# Altium schematic sheet UI_BUTTON_LED.SchDoc
size 297 x 209 mm
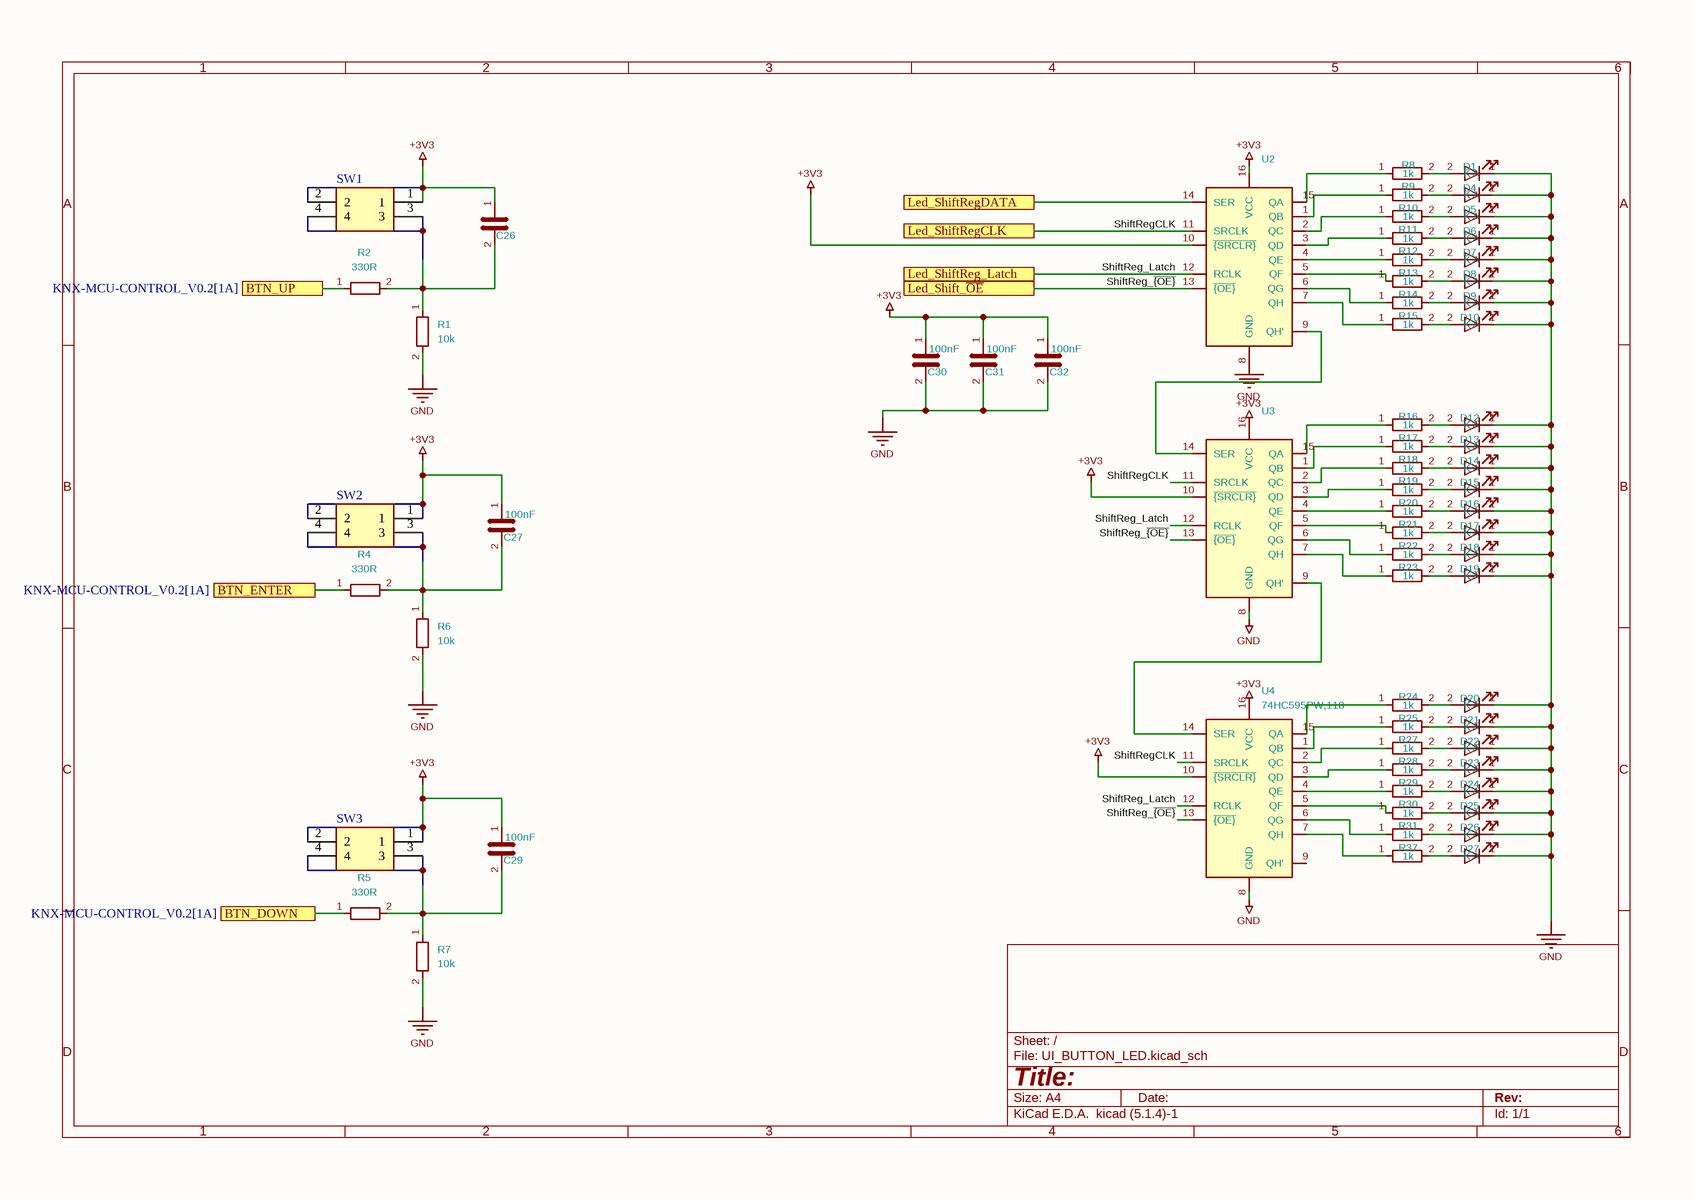
[diagram p0: UI_BUTTON_LED.SchDoc]

## Parts
C26  100nF  [C_0603_1608Metric]  (value not drawn)
C27  100nF  [C_0603_1608Metric]
C29  100nF  [C_0603_1608Metric]
C30  100nF  [C_0603_1608Metric]
C31  100nF  [C_0603_1608Metric]
C32  100nF  [C_0603_1608Metric]
D1  LED  [LED_0603_1608Metric]  (value not drawn)
D4  LED  [LED_0603_1608Metric]  (value not drawn)
D5  LED  [LED_0603_1608Metric]  (value not drawn)
D6  LED  [LED_0603_1608Metric]  (value not drawn)
D7  LED  [LED_0603_1608Metric]  (value not drawn)
D8  LED  [LED_0603_1608Metric]  (value not drawn)
D9  LED  [LED_0603_1608Metric]  (value not drawn)
D10  LED  [LED_0603_1608Metric]  (value not drawn)
D12  LED  [LED_0603_1608Metric]  (value not drawn)
D13  LED  [LED_0603_1608Metric]  (value not drawn)
D14  LED  [LED_0603_1608Metric]  (value not drawn)
D15  LED  [LED_0603_1608Metric]  (value not drawn)
D16  LED  [LED_0603_1608Metric]  (value not drawn)
D17  LED  [LED_0603_1608Metric]  (value not drawn)
D18  LED  [LED_0603_1608Metric]  (value not drawn)
D19  LED  [LED_0603_1608Metric]  (value not drawn)
D20  LED  [LED_0603_1608Metric]  (value not drawn)
D21  LED  [LED_0603_1608Metric]  (value not drawn)
D22  LED  [LED_0603_1608Metric]  (value not drawn)
D23  LED  [LED_0603_1608Metric]  (value not drawn)
D24  LED  [LED_0603_1608Metric]  (value not drawn)
D25  LED  [LED_0603_1608Metric]  (value not drawn)
D26  LED  [LED_0603_1608Metric]  (value not drawn)
D27  LED  [LED_0603_1608Metric]  (value not drawn)
R1  10k  [R_0603_1608Metric]
R2  330R  [R_0603_1608Metric]
R4  330R  [R_0603_1608Metric]
R5  330R  [R_0603_1608Metric]
R6  10k  [R_0603_1608Metric]
R7  10k  [R_0603_1608Metric]
R8  1k  [R_0603_1608Metric]
R9  1k  [R_0603_1608Metric]
R10  1k  [R_0603_1608Metric]
R11  1k  [R_0603_1608Metric]
R12  1k  [R_0603_1608Metric]
R13  1k  [R_0603_1608Metric]
R14  1k  [R_0603_1608Metric]
R15  1k  [R_0603_1608Metric]
R16  1k  [R_0603_1608Metric]
R17  1k  [R_0603_1608Metric]
R18  1k  [R_0603_1608Metric]
R19  1k  [R_0603_1608Metric]
R20  1k  [R_0603_1608Metric]
R21  1k  [R_0603_1608Metric]
R22  1k  [R_0603_1608Metric]
R23  1k  [R_0603_1608Metric]
R24  1k  [R_0603_1608Metric]
R25  1k  [R_0603_1608Metric]
R27  1k  [R_0603_1608Metric]
R28  1k  [R_0603_1608Metric]
R29  1k  [R_0603_1608Metric]
R30  1k  [R_0603_1608Metric]
R31  1k  [R_0603_1608Metric]
R37  1k  [R_0603_1608Metric]
SW1  TSA06141-225B532CA-3C00  [TL1105]  (value not drawn)
SW2  TSA06141-225B532CA-3C00  [TL1105]  (value not drawn)
SW3  TSA06141-225B532CA-3C00  [TL1105]  (value not drawn)
U2  74HC595PW,118  [TSSOP-16_4.4x5mm_P0.65mm]  (value not drawn)
U3  74HC595PW,118  [TSSOP-16_4.4x5mm_P0.65mm]  (value not drawn)
U4  74HC595PW,118  [TSSOP-16_4.4x5mm_P0.65mm]

## Ports
BTN_DOWN (see KNX-MCU-CONTROL_V0.2[1A]), BTN_ENTER (see KNX-MCU-CONTROL_V0.2[1A]), BTN_UP (see KNX-MCU-CONTROL_V0.2[1A]), Led_Shift_~{OE} (see KNX-MCU-CONTROL_V0.2[2A]), Led_ShiftReg_Latch (see KNX-MCU-CONTROL_V0.2[2A]), Led_ShiftRegCLK (see KNX-MCU-CONTROL_V0.2[2A]), Led_ShiftRegDATA (see KNX-MCU-CONTROL_V0.2[2A])

## Nets
+3V3: C26.1 C27.1 C29.1 C30.1 C31.1 C32.1 SW1.1 SW1.2 SW2.1 SW2.2 SW3.1 SW3.2 U2.10(~{{SRCLR}}) U2.16(VCC) U3.10(~{{SRCLR}}) U3.16(VCC) U4.10(~{{SRCLR}}) U4.16(VCC)
GND: C30.2 C31.2 C32.2 D1.1(K) D4.1(K) D5.1(K) D6.1(K) D7.1(K) D8.1(K) D9.1(K) D10.1(K) D12.1(K) D13.1(K) D14.1(K) D15.1(K) D16.1(K) D17.1(K) D18.1(K) D19.1(K) D20.1(K) D21.1(K) D22.1(K) D23.1(K) D24.1(K) D25.1(K) D26.1(K) D27.1(K) R1.2 R6.2 R7.2 U2.8(GND) U3.8(GND) U4.8(GND)
BTN_DOWN: R5.1 ; port BTN_DOWN
BTN_ENTER: R4.1 ; port BTN_ENTER
BTN_UP: R2.1 ; port BTN_UP
Led_ShiftRegDATA: U2.14(SER) ; port Led_ShiftRegDATA
ShiftReg_Latch: U2.12(RCLK) U3.12(RCLK) U4.12(RCLK) ; port Led_ShiftReg_Latch
ShiftReg_~{{OE}}: U2.13(~{{OE}}) U3.13(~{{OE}}) U4.13(~{{OE}}) ; port Led_Shift_~{OE}
ShiftRegCLK: U2.11(SRCLK) U3.11(SRCLK) U4.11(SRCLK) ; port Led_ShiftRegCLK
NetC26_2: C26.2 R1.1 R2.2 SW1.3 SW1.4
NetC27_2: C27.2 R4.2 R6.1 SW2.3 SW2.4
NetC29_2: C29.2 R5.2 R7.1 SW3.3 SW3.4
NetD1_2: D1.2(A) R8.2
NetD4_2: D4.2(A) R9.2
NetD5_2: D5.2(A) R10.2
NetD6_2: D6.2(A) R11.2
NetD7_2: D7.2(A) R12.2
NetD8_2: D8.2(A) R13.2
NetD9_2: D9.2(A) R14.2
NetD10_2: D10.2(A) R15.2
NetD12_2: D12.2(A) R16.2
NetD13_2: D13.2(A) R17.2
NetD14_2: D14.2(A) R18.2
NetD15_2: D15.2(A) R19.2
NetD16_2: D16.2(A) R20.2
NetD17_2: D17.2(A) R21.2
NetD18_2: D18.2(A) R22.2
NetD19_2: D19.2(A) R23.2
NetD20_2: D20.2(A) R24.2
NetD21_2: D21.2(A) R25.2
NetD22_2: D22.2(A) R27.2
NetD23_2: D23.2(A) R28.2
NetD24_2: D24.2(A) R29.2
NetD25_2: D25.2(A) R30.2
NetD26_2: D26.2(A) R31.2
NetD27_2: D27.2(A) R37.2
NetR8_1: R8.1 U2.15(QA)
NetR9_1: R9.1 U2.1(QB)
NetR10_1: R10.1 U2.2(QC)
NetR11_1: R11.1 U2.3(QD)
NetR12_1: R12.1 U2.4(QE)
NetR13_1: R13.1 U2.5(QF)
NetR14_1: R14.1 U2.6(QG)
NetR15_1: R15.1 U2.7(QH)
NetR16_1: R16.1 U3.15(QA)
NetR17_1: R17.1 U3.1(QB)
NetR18_1: R18.1 U3.2(QC)
NetR19_1: R19.1 U3.3(QD)
NetR20_1: R20.1 U3.4(QE)
NetR21_1: R21.1 U3.5(QF)
NetR22_1: R22.1 U3.6(QG)
NetR23_1: R23.1 U3.7(QH)
NetR24_1: R24.1 U4.15(QA)
NetR25_1: R25.1 U4.1(QB)
NetR27_1: R27.1 U4.2(QC)
NetR28_1: R28.1 U4.3(QD)
NetR29_1: R29.1 U4.4(QE)
NetR30_1: R30.1 U4.5(QF)
NetR31_1: R31.1 U4.6(QG)
NetR37_1: R37.1 U4.7(QH)
NetU2_9: U2.9(QH') U3.14(SER)
NetU3_9: U3.9(QH') U4.14(SER)

Not connected (* = marked no-connect by the designer): U4 9(QH')

## Notes on the sheet
- 1
- 2
- 3
- 4
- 5
- 6
- A
- B
- C
- D
- Title:
- File: UI_BUTTON_LED.kicad_sch
- Sheet: /
- KiCad E.D.A.  kicad (5.1.4)-1
- Size: A4
- Date:
- Rev:
- Id: 1/1

## Library data of the parts
C26 C27 C29 = C_3: Manufacturer Part Number: CC0603KRX7R9BB104; Manufacturer: YAGEO; Value: 100nF; Footprint: Capacitor_SMD:C_0603_1608Metric
C30-C32 = C_1: Manufacturer Part Number: CC0603KRX7R9BB104; Manufacturer: YAGEO; Value: 100nF; Footprint: Capacitor_SMD:C_0603_1608Metric
D1 D4-D10 D12-D27 = LED: Manufacturer: LITEON; Manufacturer Part Number: LTST-C190KFKT-5A; Value: LED; Footprint: LED_SMD:LED_0603_1608Metric
R1 R6 R7 = R: Manufacturer: FOJAN; Manufacturer Part Number: FRC0603J103TS; Value: 10k; Footprint: Resistor_SMD:R_0603_1608Metric
R2 R4 R5 = R: Manufacturer: FOJAN; Manufacturer Part Number: FRC0603J331 TS; Value: 330R; Footprint: Resistor_SMD:R_0603_1608Metric
R8-R25 R27-R31 R37 = R: Manufacturer: YAGEO; Manufacturer Part Number: RC0603JR-071KL; Value: 1k; Footprint: Resistor_SMD:R_0603_1608Metric
SW1-SW3 = TL1105BF160Q: Through Hole-4P,8.2x7.6mm; Manufacturer: Khon; Manufacturer Part Number: TSA06141-225B532CA-3C00
U2-U4 = 74HC595: Manufacturer: Nexperia; Manufacturer Part Number: 74HC595PW,118; Value: 74HC595PW,118; Footprint: Package_SO:TSSOP-16_4.4x5mm_P0.65mm